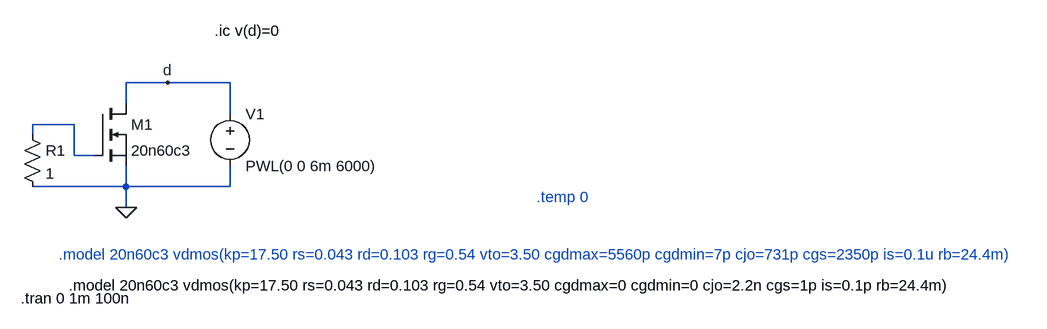
[diagram p0: schematic body diode cjo.asc]
body diode cjo.asc, the LTspice schematic file:
Version 4
SHEET 1 1708 680
WIRE 176 176 112 176
WIRE 272 176 176 176
WIRE 112 208 112 176
WIRE 272 224 272 176
WIRE 32 240 -32 240
WIRE -32 256 -32 240
WIRE 32 288 32 240
WIRE 64 288 32 288
WIRE 112 336 112 304
WIRE 112 336 -32 336
WIRE 272 336 272 304
WIRE 272 336 112 336
WIRE 112 368 112 336
FLAG 112 368 0
FLAG 176 176 d
SYMBOL nmos 64 208 R0
SYMATTR InstName M1
SYMATTR Value 20n60c3
SYMBOL res -48 240 R0
SYMATTR InstName R1
SYMATTR Value 1
SYMBOL voltage 272 208 R0
WINDOW 123 0 0 Left 0
WINDOW 39 0 0 Left 0
SYMATTR InstName V1
SYMATTR Value PWL(0 0 6m 6000)
TEXT 8 440 Left 0 ;.model 20n60c3 vdmos(kp=17.50 rs=0.043 rd=0.103 rg=0.54 vto=3.50 cgdmax=5560p cgdmin=7p cjo=731p cgs=2350p is=0.1u rb=24.4m)
TEXT 744 352 Left 0 ;.temp 0
TEXT 24 488 Left 0 !.model 20n60c3 vdmos(kp=17.50 rs=0.043 rd=0.103 rg=0.54 vto=3.50 cgdmax=0 cgdmin=0 cjo=2.2n cgs=1p is=0.1p rb=24.4m)
TEXT -50 508 Left 0 !.tran 0 1m 100n
TEXT 248 96 Left 0 !.ic v(d)=0

The netlist it stands for:
* body diode cjo.asc
M1 d N001 0 0 20n60c3
R1 N001 0 1
V1 d 0 PWL(0 0 6m 6000)
.model NMOS NMOS
.model PMOS PMOS
.lib standard.mos
* .model 20n60c3 vdmos(kp=17.50 rs=0.043 rd=0.103 rg=0.54 vto=3.50 cgdmax=5560p cgdmin=7p cjo=731p cgs=2350p is=0.1u rb=24.4m)
* .temp 0
.model 20n60c3 vdmos(kp=17.50 rs=0.043 rd=0.103 rg=0.54 vto=3.50 cgdmax=0 cgdmin=0 cjo=2.2n cgs=1p is=0.1p rb=24.4m)
.tran 0 1m 100n
.ic v(d)=0
.backanno
.end